# EAGLE schematic PCB_WiFiModule to Xbee rev0.2 (EAGLE 8.3.1)
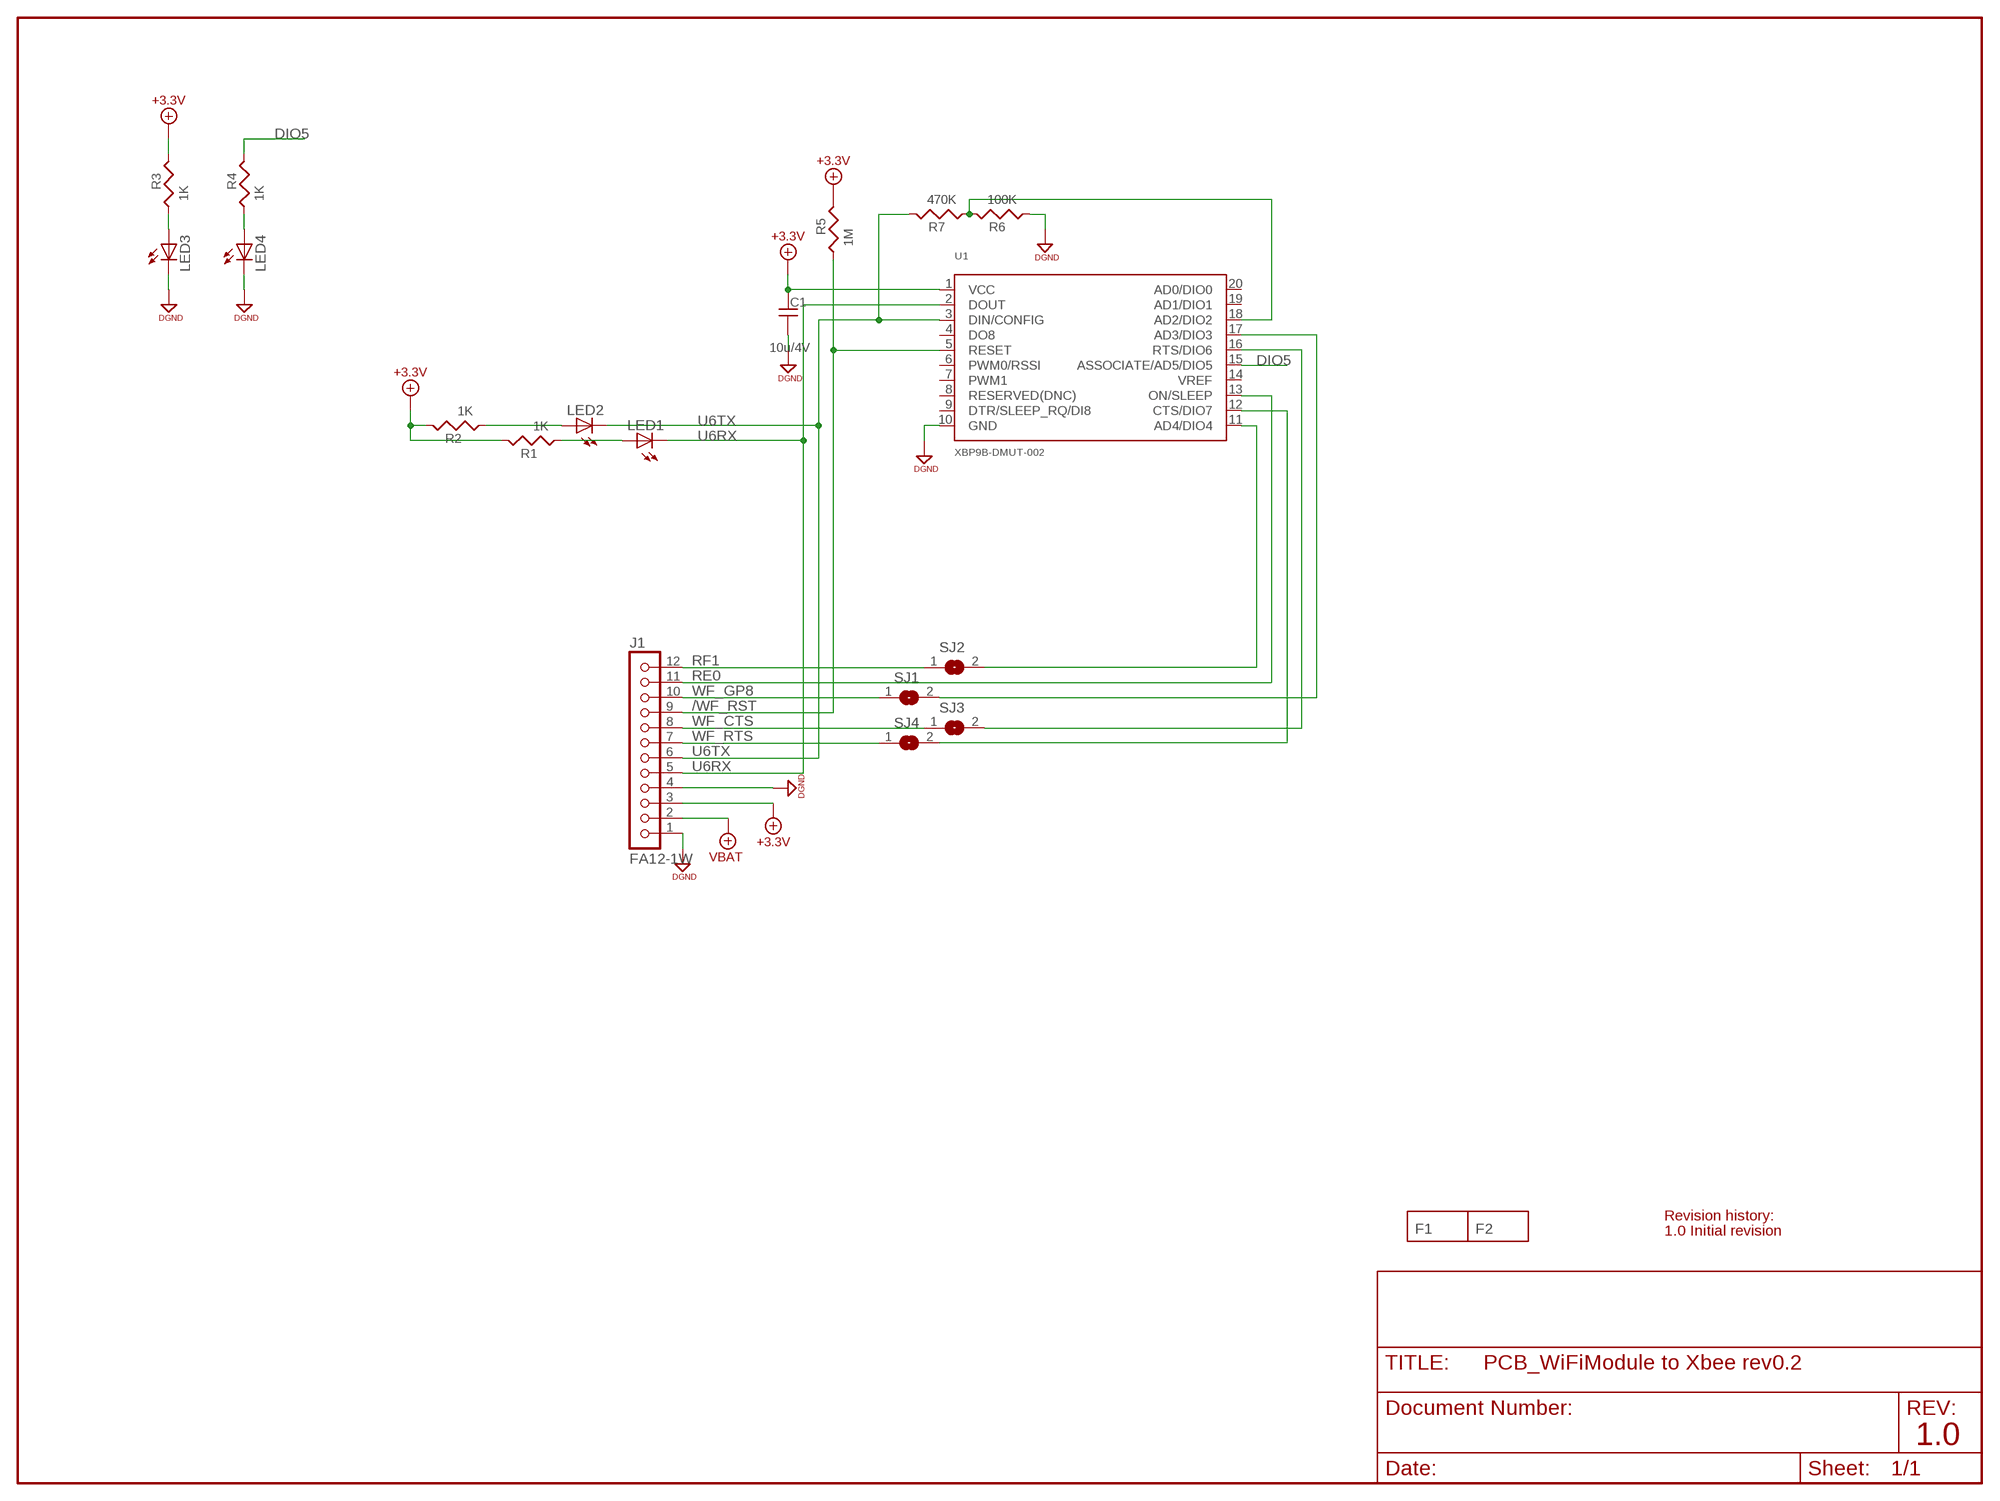
[diagram p0: schematic, sheet 1]

## Parts
C1  10u/4V  C-0603  [0603]
F1  REF  [REF]
F2  REF  [REF]
J1  FA12-1W  [FA12-1W]
LED1  LEDCHIP-LED0603  [CHIP-LED0603]
LED2  LEDCHIP-LED0603  [CHIP-LED0603]
LED3  LEDCHIP-LED0603  [CHIP-LED0603]
LED4  LEDCHIP-LED0603  [CHIP-LED0603]
R1  1K  R-0603  [0603]
R2  1K  R-0603  [0603]
R3  1K  R-0603  [0603]
R4  1K  R-0603  [0603]
R5  1M  R-0603  [0603]
R6  100K  R-0603  [0603]
R7  470K  R-0603  [0603]
SJ1  SJ  [SJ]
SJ2  SJ  [SJ]
SJ3  SJ  [SJ]
SJ4  SJ  [SJ]
U1  XBP9B-DMUT-002  [XBP9B-DMUT-002]

## Nets
+3.3V: C1.1 J1.3 R1.2 R2.2 R3.2 R5.2 U1.1(VCC)
/WF_RST: J1.9 R5.1 U1.5(RESET)
DGND: C1.2 J1.1 J1.4 LED3.C LED4.C R6.1 U1.10(GND)
DIO5: R4.2 U1.15(ASSOCIATE/AD5/DIO5)
N$1: LED4.A R4.1
N$2: LED1.A R1.1
N$3: LED2.A R2.1
N$4: R6.2 R7.1 U1.18(AD2/DIO2)
N$8: LED3.A R3.1
N$9: SJ4.2 U1.12(CTS/DIO7)
N$10: SJ2.2 U1.11(AD4/DIO4)
N$11: SJ3.2 U1.16(RTS/DIO6)
N$12: SJ1.2 U1.17(AD3/DIO3)
RE0: J1.11 U1.13(ON/SLEEP)
RF1: J1.12 SJ2.1
U6RX: J1.5 LED1.C U1.2(DOUT)
U6TX: J1.6 LED2.C R7.2 U1.3(DIN/CONFIG)
VBAT: J1.2
WF_CTS: J1.8 SJ3.1
WF_GP8: J1.10 SJ1.1
WF_RTS: J1.7 SJ4.1
Unconnected: U1.4(DO8) U1.6(PWM0/RSSI) U1.7(PWM1) U1.8(RESERVED(DNC)) U1.9(DTR/SLEEP_RQ/DI8) U1.14(VREF) U1.19(AD1/DIO1) U1.20(AD0/DIO0)

## Notes on the sheet
- Revision history:
- 1.0 Initial revision
- 1.0

## Library data of the parts
C1 = discrete:C-0603
F1 F2 = technol:REF
J1 = CON-pinHeader-AON:FA12-1W
LED1-LED4 = adafruit:LED: LED OSRAM: - CHIPLED LG R971, LG N971, LY N971, LG Q971, LY Q971, LO R971, LY R971 LH N974, LH R974 LS Q976, LO Q976, LY Q976 LO Q996 - Hyper CHIPLED LW Q18S LB Q993, LB Q99A, LB R99A - SideLED LS A670, LO A670, LY A670, LG A670, LP A670 LB A673, LV A673, LT A673, LW A673 LH A674 LY A675 LS A676, LA A676, LO A676, LY A676, LW A676 LS A679, LY A679, LG A679 - Hyper Micro SIDELED® LS Y876, LA Y876, LO Y876, LY Y876 LT Y87S - SmartLED LW L88C, LW L88S LB L89C, LB L89S, LG L890 LS L89K, LO L89K, LY L89K LS L896, LA L896, LO L896, LY L896 - TOPLED LS T670, LO T670, LY T670, LG T670, LP T670 LSG T670, LSP T670, LSY T670, LOP T670, LYG T670 LG T671, LOG T671, LSG T671 LB T673, LV T673, LT T673, LW T673 LH T674 LS T676, LA T676, LO T676, LY T676, LB T676, LH T676, LSB T676, LW T676 LB T67C, LV T67C, LT T67C, LS T67K, LO T67K, LY T67K, LW E67C LS E67B, LA E67B, LO E67B, LY E67B, LB E67C, LV E67C, LT E67C LW T67C LS T679, LY T679, LG T679 LS T770, LO T770, LY T770, LG T770, LP T770 LB T773, LV T773, LT T773, LW T773 LH T774 LS E675, LA E675, LY E675, LS T675 LS T776, LA T776, LO T776, LY T776, LB T776 LHGB T686 LT T68C, LB T68C - Hyper Mini TOPLED® LB M676 - Mini TOPLED Santana® LG M470 LS M47K, LO M47K, LY M47K Source: http://www.osram.convergy.de/
R1-R7 = discrete:R-0603
SJ1-SJ4 = jumper:SJ: SMD solder JUMPER
U1 = clackboard_lib:XBP9B-DMUT-002